# EAGLE design my (EAGLE 7.5.0)
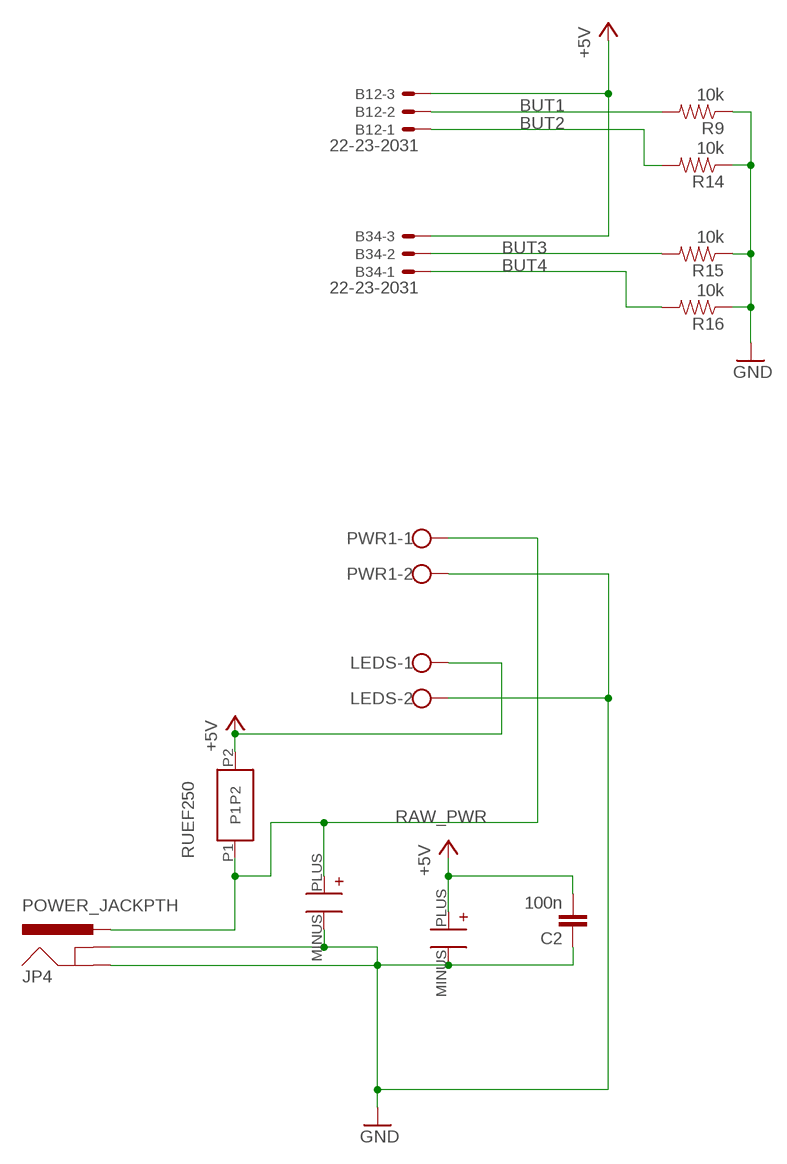
[diagram p0: schematic, sheet 1, part 1 of 2]
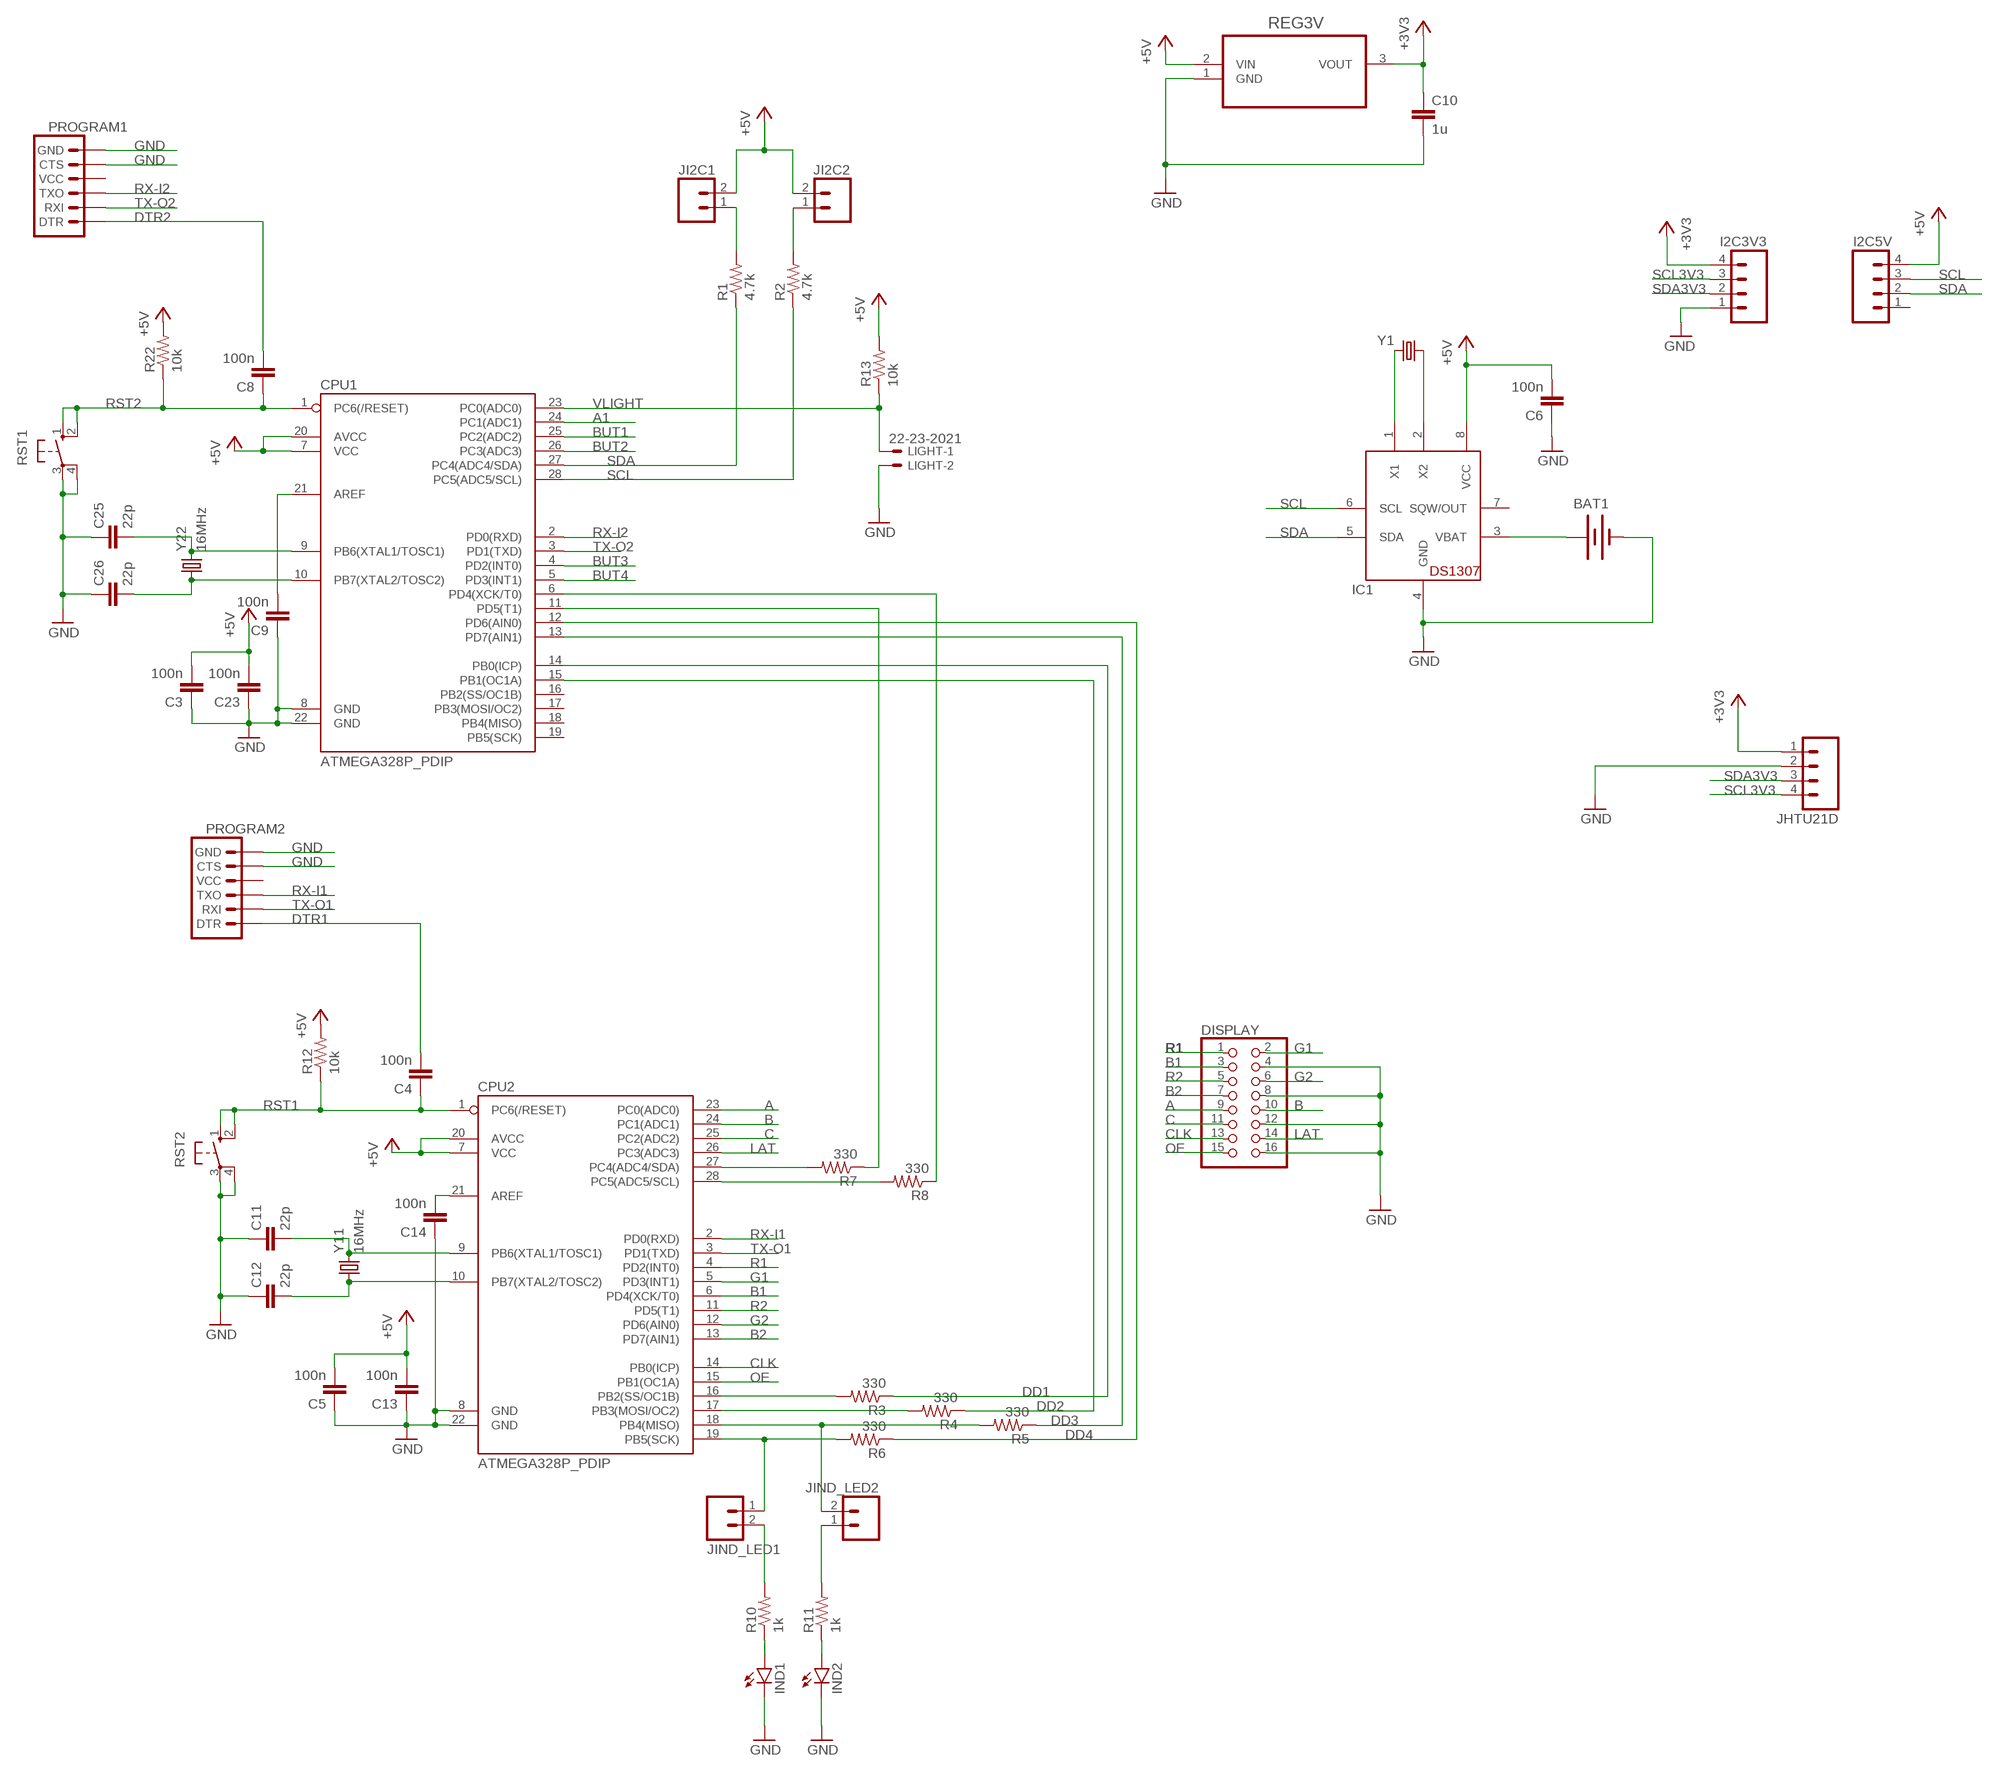
[diagram p1: schematic, sheet 1, part 2 of 2]

## Parts
B12  22-23-2031  [22-23-2031]
B34  22-23-2031  [22-23-2031]
BAT1  BATTERY12MM  [BATTCON_12MM]
C1  EEU-FR1C471B  [EEU-FR1C471B]
C2  100n  C-EU025-024X044  [C025-024X044]
C3  100n  C-EU025-024X044  [C025-024X044]
C4  100n  C-EU025-024X044  [C025-024X044]
C5  100n  C-EU025-024X044  [C025-024X044]
C6  100n  C-EU025-024X044  [C025-024X044]
C7  EEU-FR1C471B  [EEU-FR1C471B]
C8  100n  C-EU025-024X044  [C025-024X044]
C9  100n  C-EU025-024X044  [C025-024X044]
C10  1u  CAP_  [AXIAL-5MM]
C11  22p  C-EU025-024X044  [C025-024X044]
C12  22p  C-EU025-024X044  [C025-024X044]
C13  100n  C-EU025-024X044  [C025-024X044]
C14  100n  C-EU025-024X044  [C025-024X044]
C23  100n  C-EU025-024X044  [C025-024X044]
C25  22p  C-EU025-024X044  [C025-024X044]
C26  22p  C-EU025-024X044  [C025-024X044]
CPU1  ATMEGA328P_PDIP  [DIL28-3]
CPU2  ATMEGA328P_PDIP  [DIL28-3]
DISPLAY  PINHD-2X8  [2X08]
I2C3V3  M04PTH  [1X04]
I2C5V  M04PTH  [1X04]
IC1  DS1307  [DIL08]
IND1  LED5MM  [LED5MM]
IND2  LED5MM  [LED5MM]
JHTU21D  M04PTH  [1X04]
JI2C1  M02PTH  [1X02]
JI2C2  M02PTH  [1X02]
JIND_LED1  M02PTH  [1X02]
JIND_LED2  M02PTH  [1X02]
JP4  POWER_JACKPTH  [POWER_JACK_PTH]
LEDS  W237-102  [W237-102]
LIGHT  22-23-2021  [22-23-2021]
PROGRAM1  ARDUINO_SERIAL_PROGRAMPTH  [1X06]
PROGRAM2  ARDUINO_SERIAL_PROGRAMPTH  [1X06]
PWR1  W237-102  [W237-102]
R1  4.7k  RESISTORAXIAL-0.3  [AXIAL-0.3]
R2  4.7k  RESISTORAXIAL-0.3  [AXIAL-0.3]
R3  330  RESISTORAXIAL-0.3  [AXIAL-0.3]
R4  330  RESISTORAXIAL-0.3  [AXIAL-0.3]
R5  330  RESISTORAXIAL-0.3  [AXIAL-0.3]
R6  330  RESISTORAXIAL-0.3  [AXIAL-0.3]
R7  330  RESISTORAXIAL-0.3  [AXIAL-0.3]
R8  330  RESISTORAXIAL-0.3  [AXIAL-0.3]
R9  10k  RESISTORAXIAL-0.3  [AXIAL-0.3]
R10  1k  RESISTORAXIAL-0.3  [AXIAL-0.3]
R11  1k  RESISTORAXIAL-0.3  [AXIAL-0.3]
R12  10k  RESISTORAXIAL-0.3  [AXIAL-0.3]
R13  10k  RESISTORAXIAL-0.3  [AXIAL-0.3]
R14  10k  RESISTORAXIAL-0.3  [AXIAL-0.3]
R15  10k  RESISTORAXIAL-0.3  [AXIAL-0.3]
R16  10k  RESISTORAXIAL-0.3  [AXIAL-0.3]
R22  10k  RESISTORAXIAL-0.3  [AXIAL-0.3]
REG3V  MCP1700-3002E/TO  [TO127P254X495-3]
RST1  10-XX  [B3F-10XX]
RST2  10-XX  [B3F-10XX]
RUEF250  RUEF250U  [RUEF250U]
Y1  CRYSTAL32-SMD  [CRYSTAL-32KHZ-SMD]
Y11  16MHz  CRYSTALHC49US  [HC49US]
Y22  16MHz  CRYSTALHC49US  [HC49US]

## Nets
+3V3 [SUPPLY]: C10.P$1 I2C3V3.4 JHTU21D.1 REG3V.3(VOUT)
+5V [SUPPLYP]: B12.3 B34.3 C1.PLUS C2.2 C3.2 C5.2 C6.2 C13.2 C23.2 CPU1.7(VCC) CPU1.20(AVCC) CPU2.7(VCC) CPU2.20(AVCC) I2C5V.4 IC1.8(VCC) JI2C1.2 JI2C2.2 LEDS.1 R12.P$2 R13.P$2 R22.P$2 REG3V.2(VIN) RUEF250.P2
+5V1: JIND_LED1.2 R10.P$2
+5V2: JIND_LED2.1 R11.P$2
A: CPU2.23(PC0(ADC0)) DISPLAY.9
A1: CPU1.24(PC1(ADC1))
B: CPU2.24(PC1(ADC1)) DISPLAY.10
B1: CPU2.6(PD4(XCK/T0)) DISPLAY.3
B2: CPU2.13(PD7(AIN1)) DISPLAY.7
BUT1: B12.2 CPU1.25(PC2(ADC2)) R9.P$2
BUT2: B12.1 CPU1.26(PC3(ADC3)) R14.P$2
BUT3: B34.2 CPU1.4(PD2(INT0)) R15.P$2
BUT4: B34.1 CPU1.5(PD3(INT1)) R16.P$2
C: CPU2.25(PC2(ADC2)) DISPLAY.11
CLK: CPU2.14(PB0(ICP)) DISPLAY.13
DD1: CPU1.14(PB0(ICP)) R3.P$1
DD2: CPU1.15(PB1(OC1A)) R4.P$1
DD3: CPU1.13(PD7(AIN1)) R5.P$1
DD4: CPU1.12(PD6(AIN0)) R6.P$1
DTR1: C4.2 PROGRAM2.1(DTR)
DTR2: C8.2 PROGRAM1.1(DTR)
G1: CPU2.5(PD3(INT1)) DISPLAY.2
G2: CPU2.12(PD6(AIN0)) DISPLAY.6
GND [SUPPLY]: BAT1.GND(-) C1.MINUS C2.1 C3.1 C5.1 C6.1 C7.MINUS C9.1 C10.P$2 C11.1 C12.1 C13.1 C14.1 C23.1 C25.1 C26.1 CPU1.8(GND) CPU1.22(GND) CPU2.8(GND) CPU2.22(GND) DISPLAY.4 DISPLAY.8 DISPLAY.12 DISPLAY.16 I2C3V3.1 IC1.4(GND) IND1.K(C) IND2.K(C) JHTU21D.2 JP4.GND JP4.GNDBREAK LEDS.2 LIGHT.2 PROGRAM1.5(CTS) PROGRAM1.6(GND) PROGRAM2.5(CTS) PROGRAM2.6(GND) PWR1.2 R9.P$1 R14.P$1 R15.P$1 R16.P$1 REG3V.1(GND) RST1.3(P) RST1.4(P1) RST2.3(P) RST2.4(P1)
LAT: CPU2.26(PC3(ADC3)) DISPLAY.14
N$1 [OSC]: C11.2 CPU2.9(PB6(XTAL1/TOSC1)) Y11.2
N$2 [OSC]: C12.2 CPU2.10(PB7(XTAL2/TOSC2)) Y11.1
N$3 [OSC]: C25.2 CPU1.9(PB6(XTAL1/TOSC1)) Y22.2
N$4 [OSC]: C26.2 CPU1.10(PB7(XTAL2/TOSC2)) Y22.1
N$5: CPU1.11(PD5(T1)) R7.P$1
N$6: CPU2.19(PB5(SCK)) JIND_LED1.1 R6.P$2
N$7: CPU2.18(PB4(MISO)) JIND_LED2.2 R5.P$2
N$8: CPU2.17(PB3(MOSI/OC2)) R4.P$2
N$9: CPU2.16(PB2(SS/OC1B)) R3.P$2
N$10: CPU2.27(PC4(ADC4/SDA)) R7.P$2
N$11: CPU2.28(PC5(ADC5/SCL)) R8.P$2
N$12: CPU1.6(PD4(XCK/T0)) R8.P$1
N$13: C9.2 CPU1.21(AREF)
N$14: C14.2 CPU2.21(AREF)
N$17: JI2C1.1 R1.P$2
N$18: JI2C2.1 R2.P$2
N$19: IND2.A R11.P$1
N$20: IND1.A R10.P$1
N$24: BAT1.PWR@1(+) IC1.3(VBAT)
N$25: IC1.1(X1) Y1.X2
N$26: IC1.2(X2) Y1.X1
OE: CPU2.15(PB1(OC1A)) DISPLAY.15
R1: CPU2.4(PD2(INT0)) DISPLAY.1
R2: CPU2.11(PD5(T1)) DISPLAY.5
RAW_PWR [SUPPLY]: C7.PLUS JP4.PWR PWR1.1 RUEF250.P1
RST1: C4.1 CPU2.1(PC6(/RESET)) R12.P$1 RST2.1(S) RST2.2(S1)
RST2: C8.1 CPU1.1(PC6(/RESET)) R22.P$1 RST1.1(S) RST1.2(S1)
RX-I1: CPU2.2(PD0(RXD)) PROGRAM2.3(TXO)
RX-I2: CPU1.2(PD0(RXD)) PROGRAM1.3(TXO)
SCL: CPU1.28(PC5(ADC5/SCL)) I2C5V.3 IC1.6(SCL) R2.P$1
SCL3V3: I2C3V3.3 JHTU21D.4
SDA: CPU1.27(PC4(ADC4/SDA)) I2C5V.2 IC1.5(SDA) R1.P$1
SDA3V3: I2C3V3.2 JHTU21D.3
TX-O1: CPU2.3(PD1(TXD)) PROGRAM2.2(RXI)
TX-O2: CPU1.3(PD1(TXD)) PROGRAM1.2(RXI)
VLIGHT: CPU1.23(PC0(ADC0)) LIGHT.1 R13.P$1
Unconnected: CPU1.16(PB2(SS/OC1B)) CPU1.17(PB3(MOSI/OC2)) CPU1.18(PB4(MISO)) CPU1.19(PB5(SCK)) I2C5V.1 IC1.7(SQW/OUT) PROGRAM1.4(VCC) PROGRAM2.4(VCC)

## Library data of the parts
B12 B34 = con-molex:22-23-2031: .100" (2.54mm) Center Header - 3 Pin; MF: MOLEX; MPN: 22-23-2031; OC_FARNELL: 1462950; OC_NEWARK: 30C0862
BAT1 = SparkFun-Electromechanical:BATTERY: Battery Holders Various common sizes : AA, AAA, 18650 (PRT-12895), 20mm coin cell and 12mm coin cell. 20MM_4LEGS, BATT-10373; PROD_ID: BATT-08044
C1 C7 = my:EEU-FR1C471B
C2-C6 C8 C9 C11-C14 C23 C25 C26 = rcl:C-EU: CAPACITOR, European symbol
C10 = SparkFun-Passives:CAP: Capacitor Standard 0603 ceramic capacitor, and 0.1" leaded capacitor.
CPU1 CPU2 = SparkFun-DigitalIC:ATMEGA328P_PDIP: uC used in the Arduino 32kb flash, 1k EEPROM, 2k SRAM This is the through-hole version of this chip.
DISPLAY = pinhead:PINHD-2X8: PIN HEADER
I2C3V3 I2C5V JHTU21D = SparkFun-Connectors:M04: Header 4 Standard 4-pin 0.1" header. Use with straight break away headers (SKU : PRT-00116), right angle break away headers (PRT-00553), swiss pins (PRT-00743), machine pins (PRT-00117), and female headers (PRT-00115). Molex polarized connector foot print use with SKU : PRT-08231 with associated crimp pins and housings. 1MM SMD Version SKU: PRT-10208
IC1 = adafruit:DS1307: DS1307 Real time clock (RTC) with battery backup ability. Talk to it via i2c
IND1 IND2 = SparkFun-LED:LED: LEDs Standard schematic elements and footprints for 5mm, 3mm, 1206, and 0603 sized LEDs. 5mm - Spark Fun Electronics SKU : COM-00529 (and others)
JI2C1 JI2C2 JIND_LED1 JIND_LED2 = SparkFun-Connectors:M02: Standard 2-pin 0.1" header. Use with - straight break away headers ( PRT-00116) - right angle break away headers (PRT-00553) - swiss pins (PRT-00743) - machine pins (PRT-00117) - female headers (PRT-00115) Molex polarized connector foot print use with: PRT-08233 with associated crimp pins and housings. 2.54_SCREWTERM for use with PRT-10571. 3.5mm Screw Terminal footprints for PRT-08084 5mm Screw Terminal footprints for use with PRT-08432
JP4 = SparkFun-Connectors:POWER_JACK: Power Jack This is the standard 5.5mm barrel jack for power. The PTH is the most common, proven, reliable, footprint. The Slot footprint only works if the mill layer is transmitted to the PCB fab house so be warned. Mating wall wart : TOL-00298 (and others); PROD_ID: CONN-08197
LEDS PWR1 = con-wago-500:W237-102: WAGO SCREW CLAMP; MPN: 237-102; OC_FARNELL: unknown; OC_NEWARK: 70K9898
LIGHT = con-molex:22-23-2021: .100" (2.54mm) Center Header - 2 Pin; MF: MOLEX; MPN: 22-23-2021; OC_FARNELL: 1462926; OC_NEWARK: 25C3832
PROGRAM1 PROGRAM2 = SparkFun-Connectors:ARDUINO_SERIAL_PROGRAM: FTDI connector footprints
R1-R16 R22 = SparkFun-Passives:RESISTOR: Resistor Basic schematic elements and footprints for 0603, 1206, and PTH resistors.
REG3V = Microchip_By_element14_Batch_1:MCP1700-3002E/TO: IC REG LDO 250MA 3.0V; MPN: MCP1700-3002E/TO; OC_FARNELL: 1331480; OC_NEWARK: 34M7414; PACKAGE: TO-92; SUPPLIER: Microchip
RST1 RST2 = switch-omron:10-XX: OMRON SWITCH; MPN: B3F-1000; OC_FARNELL: 176432; OC_NEWARK: 36M3542
RUEF250 = my:RUEF250U
Y1 = SparkFun-FreqCtrl:CRYSTAL: Various standard crystals. Proven footprints.; PROD_ID: XTAL-07894
Y11 Y22 = SparkFun-FreqCtrl:CRYSTAL: Various standard crystals. Proven footprints.

## Net classes
0 default: width 0.254 mm, drill 0.381 mm, clearance 0.254 mm
1 SUPPLY: width 0.508 mm, drill 0.762 mm, clearance 0.254 mm to class 0, clearance 0.254 mm
2 SUPPLYP: width 0.762 mm, drill 0.762 mm, clearance 0.254 mm to class 0, clearance 0.254 mm to class 1, clearance 0.254 mm
3 OSC: width 0.254 mm, drill 0.381 mm, clearance 0.381 mm to class 0, clearance 0.381 mm to class 1, clearance 0.381 mm to class 2, clearance 0.381 mm

## Board
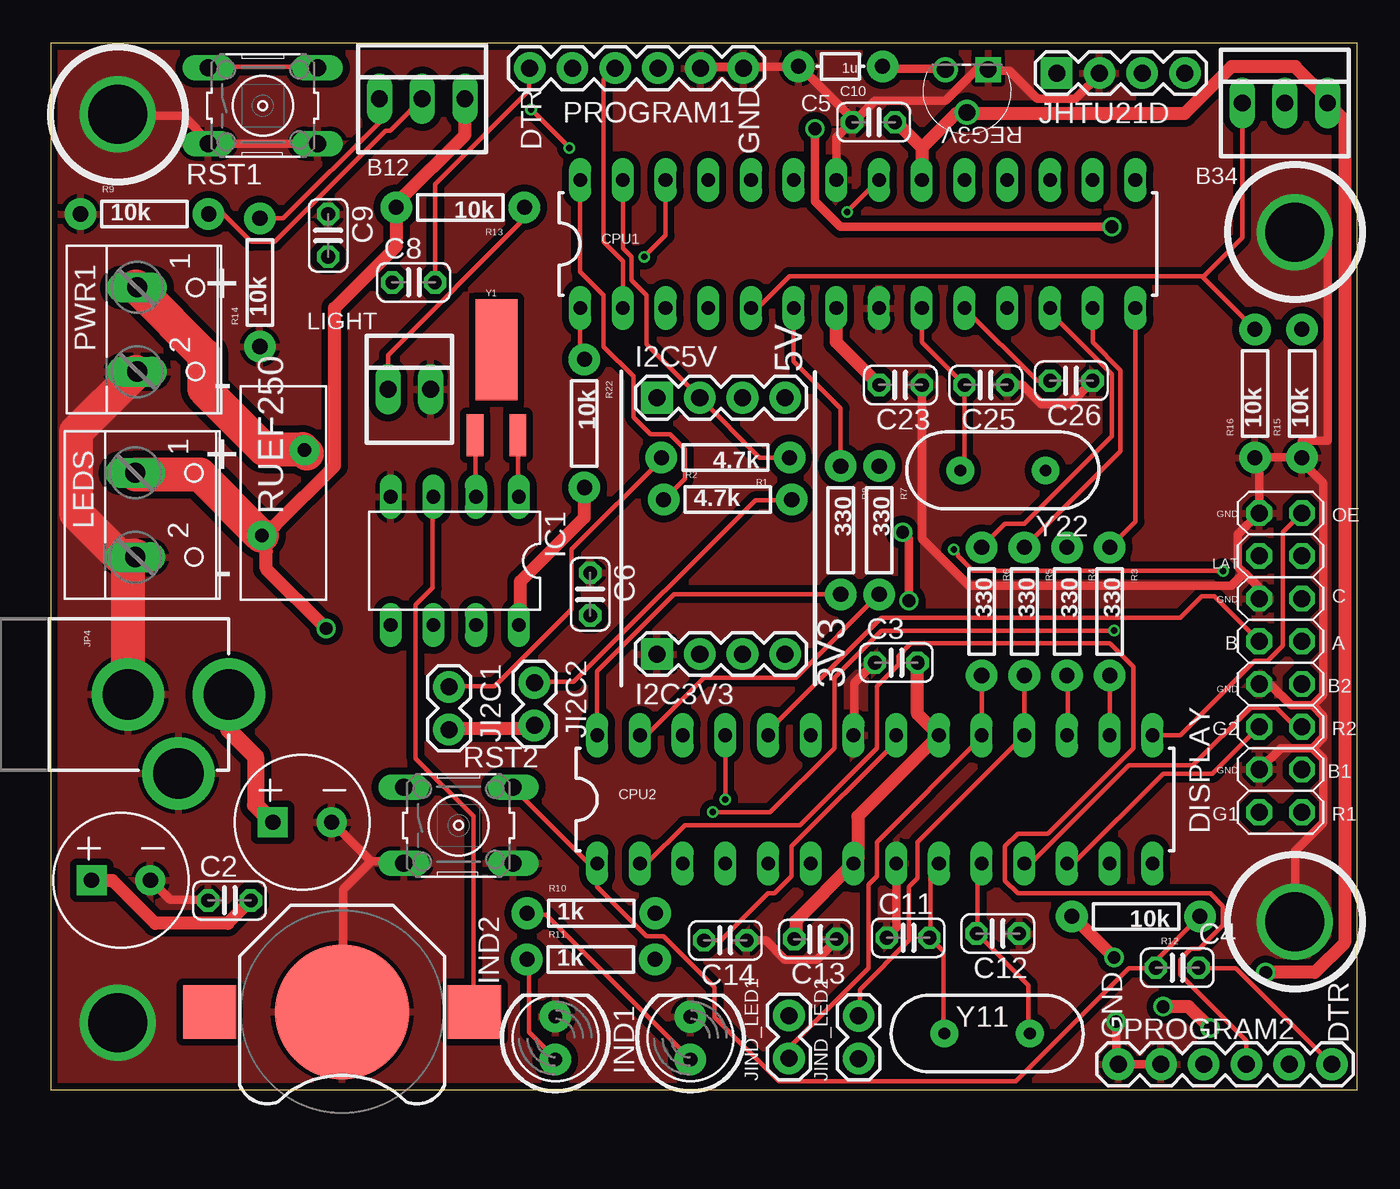
[diagram p2: board, top side]
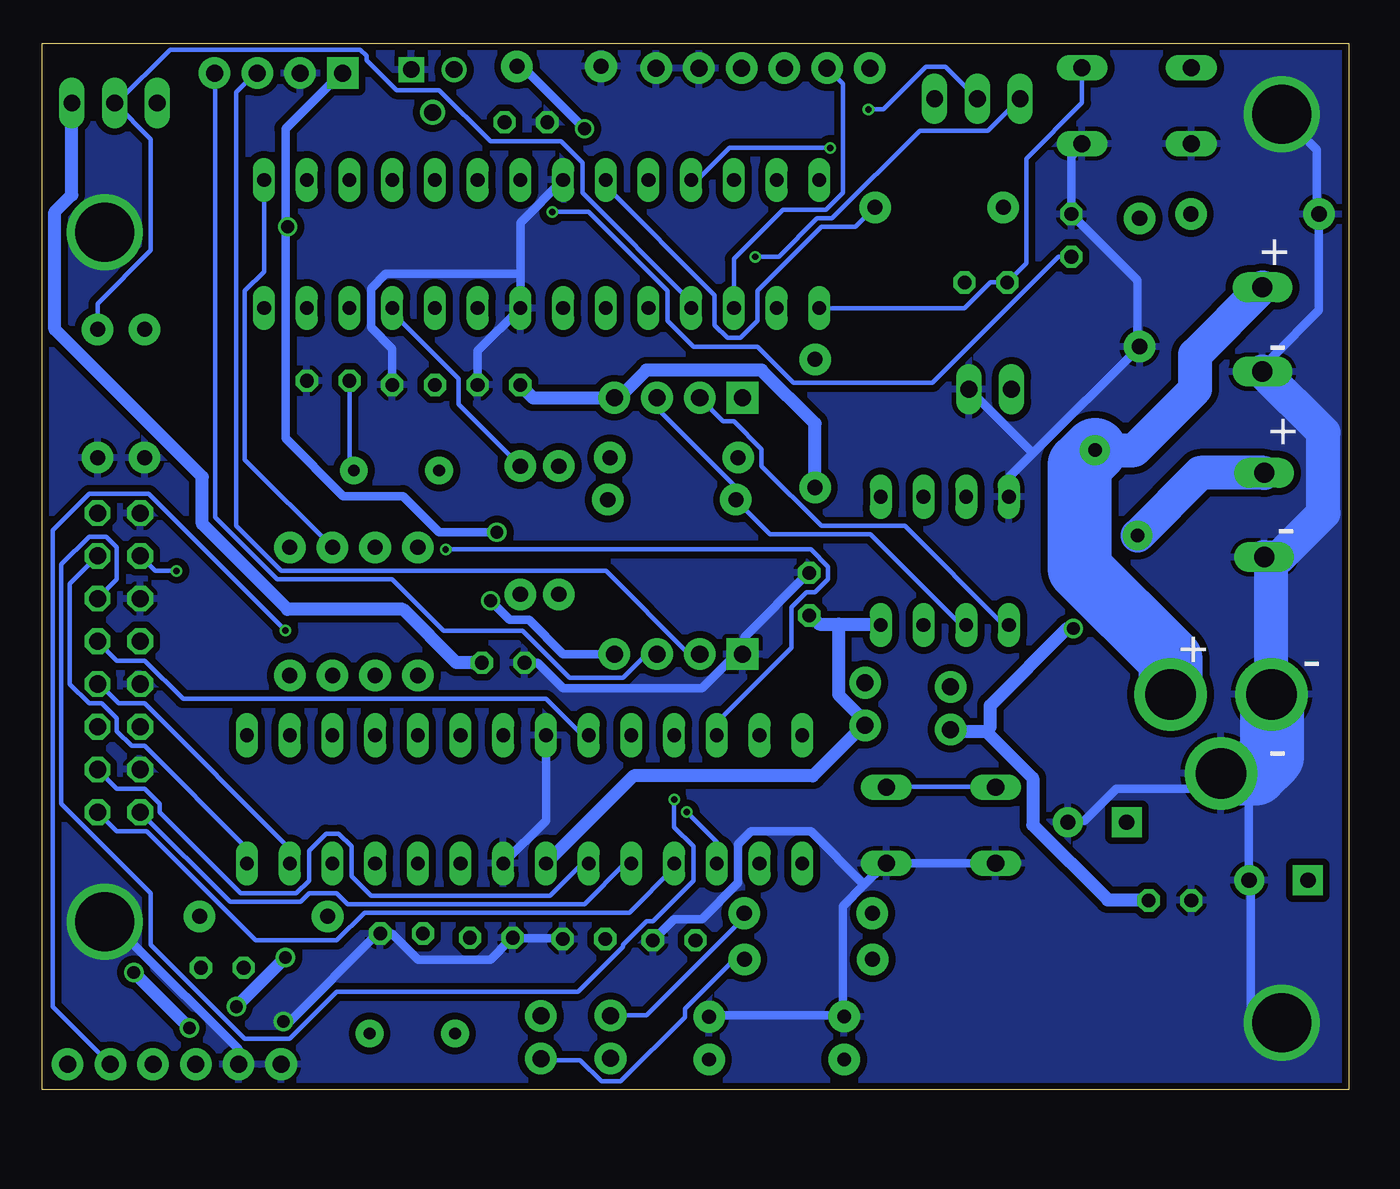
[diagram p3: board, bottom side, seen from below]

Size 77.72 x 62.23 mm. Coordinates in mm from the lower left corner, seen from the top.
Outline: 0,0 77.72,0 77.72,62.23 0,62.23 0,0
Copper layers (1*16): Top 0.035mm / dielectric 1.5mm / Bottom 0.035mm
Design rules "SeeedStudio_2layer_DRU_no_angle_20140221": minimum track width 6mil, minimum drill 12mil, track to track 6mil, track to pad 6mil, pad to pad 6mil, via to via 6mil, smd to smd 0mil, copper to edge 10mil, drill to drill 10mil, minimum pad ring 10mil, minimum via ring 6mil, stop-mask expansion 2mil, vias tented up to drill 100mil, thermal gap 10mil

### Footprints (pad centres in the part's own frame; a part is rotated, then mirrored left to right if it is on the bottom)
22-23-2031 = drill 1 long: 1 -2.54,0; 2 0,0; 3 2.54,0
BATTCON_12MM = smd 8 x 8: GND 0,0 | smd 3.175 x 3.175: PWR@1 -7.874,0; PWR@2 7.874,0
EEU-FR1C471B = drill 0.9 pad 1.778: MINUS 1.75,0 | drill 0.9 pad 1.778 square: PLUS -1.75,0
C025-024X044 = drill 0.813 octagon: 1 -1.27,0; 2 1.27,0
AXIAL-5MM = drill 0.9 pad 1.88: P$1 -2.5,0; P$2 2.5,0
DIL28-3 = drill 0.813 long: 1 -16.51,-3.81; 2 -13.97,-3.81; 3 -11.43,-3.81; 4 -8.89,-3.81; 5 -6.35,-3.81; 6 -3.81,-3.81; 7 -1.27,-3.81; 8 1.27,-3.81; 9 3.81,-3.81; 10 6.35,-3.81; 11 8.89,-3.81; 12 11.43,-3.81; 13 13.97,-3.81; 14 16.51,-3.81; 15 16.51,3.81; 16 13.97,3.81; 17 11.43,3.81; 18 8.89,3.81; 19 6.35,3.81; 20 3.81,3.81; 21 1.27,3.81; 22 -1.27,3.81; 23 -3.81,3.81; 24 -6.35,3.81; 25 -8.89,3.81; 26 -11.43,3.81; 27 -13.97,3.81; 28 -16.51,3.81
2X08 = drill 1.016 octagon: 1 -8.89,-1.27; 2 -8.89,1.27; 3 -6.35,-1.27; 4 -6.35,1.27; 5 -3.81,-1.27; 6 -3.81,1.27; 7 -1.27,-1.27; 8 -1.27,1.27; 9 1.27,-1.27; 10 1.27,1.27; 11 3.81,-1.27; 12 3.81,1.27; 13 6.35,-1.27; 14 6.35,1.27; 15 8.89,-1.27; 16 8.89,1.27
1X04 = drill 1.016 pad 1.88 square: 1 0,0 | drill 1.016 pad 1.88: 2 2.54,0; 3 5.08,0; 4 7.62,0
DIL08 = drill 0.813 long: 1 -3.81,-3.81; 2 -1.27,-3.81; 3 1.27,-3.81; 4 3.81,-3.81; 5 3.81,3.81; 6 1.27,3.81; 7 -1.27,3.81; 8 -3.81,3.81
LED5MM = drill 0.813 pad 1.88: A -1.27,0; K 1.27,0
1X02 = drill 1.016 pad 1.88: 1 0,0; 2 2.54,0
POWER_JACK_PTH = drill 2.997 pad 4.318: GND 0,7.7; GNDBREAK 4.7,10.7; PWR 0,13.7
W237-102 = drill 1.194 long: 1 -2.5,-1.27; 2 2.5,-1.27
22-23-2021 = drill 1 long: 1 -1.27,0; 2 1.27,0
1X06 = drill 1.016 pad 1.88: 1 0,0; 2 2.54,0; 3 5.08,0; 4 7.62,0; 5 10.16,0; 6 12.7,0
AXIAL-0.3 = drill 0.9 pad 1.88: P$1 -3.81,0; P$2 3.81,0
TO127P254X495-3 = drill 0.991 square: 1 -2.54,-2.54 | drill 0.991: 2 -1.27,0; 3 0,-2.54
B3F-10XX = drill 1.016 long: 1 -3.251,2.261; 2 3.251,2.261; 3 -3.251,-2.261; 4 3.251,-2.261
RUEF250U = drill 0.8 pad 1.778: P1 2.54,-1.27; P2 -2.54,1.27
CRYSTAL-32KHZ-SMD = smd 2.5 x 6: SHEILD 0,5.08 | smd 1 x 2.5: X1 -1.27,0; X2 1.27,0
HC49US = drill 0.7 pad 1.651: 1 -2.54,0; 2 2.54,0

### Placement (x,y rotation side)
B12  22.1,58.93 0 top
B34  73.41,58.67 0 top
BAT1  17.34,4.63 180 top
C1  4.19,12.45 0 top
C2  10.64,11.27 0 top
C3  50.29,25.4 0 top
C4  67.01,7.26 0 top
C5  48.95,57.53 0 top
C6  32.09,29.47 270 top
C7  14.97,15.91 0 top
C8  21.59,48.01 0 top
C9  16.51,50.8 270 top
C10  46.98,60.85 180 top
C11  51,9.04 0 top
C12  56.34,9.3 180 top
C13  45.49,8.97 180 top
C14  40.13,8.89 180 top
C23  50.55,41.91 180 top
C25  55.63,41.91 180 top
C26  60.71,42.16 180 top
CPU1  48.01,50.29 0 top
CPU2  49.02,17.27 0 top
DISPLAY  73.15,25.4 90 top
I2C3V3  36.07,25.91 0 top
I2C5V  36.07,41.15 0 top
IC1  24.03,31.45 180 top
IND1  38.05,3.08 90 top
IND2  30.02,3.09 90 top
JHTU21D  59.84,60.45 0 top
JI2C1  23.7,23.96 270 top
JI2C2  28.78,24.21 270 top
JIND_LED1  43.92,1.88 90 top
JIND_LED2  48.05,1.86 90 top
JP4  -3.09,23.52 270 top
LEDS  6.31,34.18 270 top
LIGHT  21.34,41.66 0 top
PROGRAM1  28.5,60.74 0 top
PROGRAM2  76.2,1.52 180 top
PWR1  6.41,45.21 270 top
R1  40.14,37.59 180 top
R2  40.27,35.09 0 top
R3  62.99,28.45 270 top
R4  60.45,28.45 270 top
R5  57.91,28.45 270 top
R6  55.37,28.45 270 top
R7  49.28,33.27 270 top
R8  46.99,33.27 270 top
R9  5.59,52.07 0 top
R10  32.15,10.51 0 top
R11  32.14,7.76 0 top
R12  64.55,10.32 180 top
R13  24.37,52.47 180 top
R14  12.45,48.01 90 top
R15  74.42,41.4 90 top
R16  71.63,41.4 90 top
R22  31.75,39.62 270 top
REG3V  53.22,58.12 180 top
RST1  12.62,58.51 0 top
RST2  24.26,15.72 0 top
RUEF250  13.84,35.5 90 top
Y1  26.52,38.91 0 top
Y11  55.7,3.35 180 top
Y22  56.64,36.83 180 top

### Tracks (layer width: path | path; a pad name or v marks a point on that pad's centre or on a via)
+3V3  (via drill 0.76)
  Top 0.508: REG3V.3 53.21,60.71 49.66,60.71 49.53,60.83 C10.P$1 | v51.05,29.08 51.05,32.77 v50.67,33.15 | v45.47,57.15 45.47,52.83 46.99,51.31 v63.12,51.31
  Bottom 0.508: I2C3V3.4 46.74,25.91 48.77,27.94 49.91,27.94 v51.05,29.08 | v50.67,33.15 54.1,33.15 56.26,35.31 59.82,35.31 63.25,38.73 63.25,51.31 | 63.25,51.31 63.25,57.15 59.94,60.45 JHTU21D.1 | v45.47,57.15 49.15,60.83 49.4,60.83 C10.P$1 | v63.12,51.31 63.25,51.31
+5V  (via drill 0.76)
  Top 0.762: CPU1.7 46.74,44.45 C23.2 | 51.82,56.01 CPU1.20 | 51.82,56.01 50.29,57.53 C5.2 | 51.82,56.01 53.85,58.04 54.48,58.04 REG3V.2 54.86,58.04 67.44,58.04 70.23,60.83 74.04,60.83 75.95,58.93 B34.3 76.96,57.66 76.96,8.76 75.18,6.99 v72.26,6.99 | C13.2 44.32,9.02 44.32,10.03 CPU2.7 48.01,13.72 48.01,16.26 CPU2.20 51.56,22.35 C3.2 | JI2C1.2 23.75,21.46 28.57,21.46 28.7,21.59 JI2C2.2 | R22.P$2 31.75,34.04 27.94,30.23 27.94,27.69 IC1.8 | v16.38,27.43 12.83,30.99 12.83,32 RUEF250.P2 13.34,33.53 16.89,37.08 16.89,46.48 20.57,50.16 20.57,52.07 R13.P$2 20.7,52.83 24.64,56.77 B12.3 | C1.PLUS 2.54,12.45 3.68,12.45 6.22,9.91 10.54,9.91 11.81,11.18 C2.2 | v63.25,7.87 60.83,10.29 R12.P$2 | v66.17,4.95 67.69,4.95 v68.96,3.68
  Top 2.032: RUEF250.P2 12.51,32.96 8.89,36.58 5.08,36.58
  Bottom 0.762: C23.2 48.51,41.15 I2C5V.4 43.43,41.4 43.18,41.4 41.78,42.8 34.92,42.8 31.75,39.62 R22.P$2 | 30.35,27.69 31.5,27.69 32,28.19 C6.2 | 30.35,27.69 27.94,27.69 IC1.8 | 30.35,27.69 30.35,23.5 28.83,21.97 28.83,21.72 JI2C2.2 29.08,21.46 31.88,18.67 42.55,18.67 CPU2.7 | 21.59,21.34 18.8,18.54 18.8,15.75 14.35,11.3 11.94,11.3 C2.2 | 21.59,21.34 23.62,21.34 JI2C1.2 | v16.38,27.43 16.76,27.43 21.34,22.86 21.34,21.59 21.59,21.34 | B34.3 75.95,53.21 76.96,52.2 76.96,45.21 68.2,36.45 68.2,33.66 63.12,28.57 56.26,28.57 53.09,25.4 C3.2 | v66.17,4.95 v63.25,7.87 | v72.26,6.99 v68.96,3.68
  Bottom 2.032: LEDS.1 8.85,36.68 RUEF250.P2
+5V1
  Bottom 0.254: R10.P$2 36.07,10.41 36.07,10.16 41.78,4.45 43.81,4.45 JIND_LED1.2
+5V2
  Bottom 0.254: JIND_LED2.1 48.01,1.78 45.72,1.78 44.45,0.51 43.31,0.51 39.5,4.32 39.5,4.83 36.58,7.75 36.07,7.75 R11.P$2
A
  Bottom 0.254: CPU2.23 45.59,21.08 47.75,23.24 69.34,23.24 71.63,25.53 73.28,25.53 DISPLAY.9
B
  Top 0.254: CPU2.24 42.67,21.34 49.4,28.07 67.18,28.07 68.45,29.34 69.22,29.34 DISPLAY.10
B1
  Bottom 0.254: CPU2.6 45.59,13.46 47.5,11.56 58.17,11.56 59.31,12.7 59.31,14.48 60.07,15.24 60.83,15.24 61.85,14.22 61.85,12.45 62.61,11.68 65.91,11.68 70.74,16.51 70.74,17.02 71.63,17.91 73.28,17.91 DISPLAY.3
B2
  Bottom 0.254: 74.4,24.1 DISPLAY.7 74.3,24.13 73.15,22.99 71.63,22.99 62.99,14.35 CPU2.13
BUT1  (via drill 0.38)
  Top 0.254: v28.57,58.29 v30.86,56.01 | R9.P$2 10.29,52.07 11.94,50.42 13.34,50.42 19.94,57.02 20.19,57.02 B12.2
  Bottom 0.254: CPU1.25 38.73,54.1 36.83,56.01 v30.86,56.01 | v28.57,58.29 27.69,58.29 25.15,60.83 24,60.83 B12.2
BUT2  (via drill 0.38)
  Top 0.254: R14.P$2 13.84,51.82 19.56,57.53 B12.1 | CPU1.26 36.58,50.8 v35.31,49.53
  Bottom 0.254: v35.31,49.53 33.91,49.53 31.62,51.82 30.73,51.82 25.53,57.02 21.46,57.02 B12.1
BUT3
  Bottom 0.254: R15.P$2 74.42,46.74 71.25,49.91 71.25,56.52 B34.2 73.28,58.67 70.1,61.85 58.8,61.85 58.42,61.47 58.42,61.21 56.64,59.44 54.1,59.44 51.05,56.39 46.86,56.39 45.59,55.12 45.59,53.34 39.12,46.86 CPU1.4
BUT4
  Top 0.254: CPU1.5 42.04,46.48 43.94,48.39 68.45,48.39 68.52,48.32 | R16.P$2 68.52,48.32 | B34.1 70.87,50.67 68.52,48.32
C  (via drill 0.38)
  Top 0.254: v40.13,17.27 CPU2.25
  Bottom 0.254: v40.13,17.27 40.13,15.62 38.99,14.48 38.99,12.45 41.4,10.03 41.78,10.03 43.18,8.64 43.18,8.51 45.85,5.84 60.2,5.84 62.99,3.05 65.66,3.05 71.25,8.64 71.25,11.68 76.58,17.02 76.58,31.24 74.93,32.89 73.91,32.89 73.28,32.26 73.28,30.35 DISPLAY.11
CLK
  Bottom 0.254: CPU2.14 65.53,14.35 71.63,20.45 72.39,20.45 73.28,21.34 73.28,22.1 74.17,22.99 74.93,22.99 76.07,24.13 76.07,30.1 DISPLAY.13
DD1
  Top 0.254: CPU1.14 64.52,33.78 R3.P$1
DD2
  Bottom 0.254: CPU1.15 64.52,48.64 65.66,47.5 65.66,37.47 R4.P$1
DD3
  Top 0.254: CPU1.13 61.98,44.45 63.63,42.8 63.63,37.97 R5.P$1
DD4
  Top 0.254: CPU1.12 59.44,46.23 63.12,42.55 63.12,38.86 57.91,33.66 56.77,33.66 R6.P$1
DTR1
  Top 0.254: PROGRAM2.1 70.48,7.24 68.33,7.24 C4.2
DTR2
  Top 0.254: C8.2 22.86,53.85 28.45,59.44 28.45,60.71 PROGRAM1.1
G1
  Bottom 0.254: CPU2.5 43.05,13.46 45.47,11.05 59.56,11.05 60.2,11.68 61.85,11.68 62.36,11.18 66.55,11.18 DISPLAY.2
G2
  Top 0.254: CPU2.12 60.83,13.46 66.17,18.8 69.09,18.8 DISPLAY.6
GND  (via drill 0.76, 3.5)
  Top 0.508: R15.P$1 74.2,37.6 71.7,37.6 R16.P$1 71.88,37.47 DISPLAY.16 70.61,33.02 70.61,31.11 70.99,30.73 | CPU2.22 47.8,21.1 47.8,24.2 49,25.4 C3.1 | C2.1 9.3,11.3 7.1,11.3 6,12.4 C1.MINUS | 75.06,20.32 75.69,19.68 75.69,15.88 74.04,14.22 74.04,10.03 v74,10 | 75.06,20.32 73.15,20.32 DISPLAY.4 | 19.05,13.59 20.95,13.59 RST2.3 | 19.05,13.59 16.76,15.88 C7.MINUS | 19.05,13.59 17.4,11.94 17.4,4.7 BAT1.GND | v4,58 4.06,57.91 7.87,57.91 9.53,56.26 RST1.3 9.78,56.26 15.75,56.26 RST1.4 | JHTU21D.2 62.48,60.45 60.96,58.93 58.67,58.93 57.02,60.58 55.88,60.58 REG3V.1 55.5,60.71 55.12,60.71 53.21,58.8 49.02,58.8 47.88,57.66 C5.1 | CPU1.22 46.74,56.64 47.62,57.53 C5.1 | C5.1 47.5,57.66 47.5,57.91 44.7,60.71 C10.P$2 44.32,60.83 41.4,60.83 PROGRAM1.6 41.15,60.83 38.73,60.83 PROGRAM1.5 | DISPLAY.12 71.88,29.84 70.99,30.73 | DISPLAY.8 72.52,24.13 73.79,22.86 75.06,22.86 | 75.06,22.86 75.69,22.23 75.69,20.95 75.06,20.32 | 75.06,22.86 75.69,23.5 75.69,36.07 74.42,37.34 R15.P$1 | PROGRAM2.5 PROGRAM2.6 63.37,1.65 v63.37,4.06 | CPU2.8 50.29,9.65 49.78,9.14 C11.1 | C25.1 57.78,41.91 58.93,40.77 60.58,40.77 C26.1 | C23.1 51.82,32.77 54.61,29.97 70.23,29.97 70.99,30.73 | C14.1 42.55,8.89 43.69,7.75 45.59,7.75 46.74,8.89 C13.1 | v74,51 75.95,51 75.95,38.61 74.42,38.61 R15.P$1
  Top 2.032: JP4.GND 4.61,31.28 5.08,31.75 4.06,31.75 1.52,34.29 1.52,39.12 5.08,42.67
  Bottom 0.508: 4.06,4.06 v4,4 5.84,4.19 5.84,12.45 C1.MINUS 5.97,12.7 5.97,17.02 5.57,18.82 | 1.78,52.32 R9.P$1 | IND1.K 37.97,4.45 30.1,4.45 IND2.K 30.1,4.7 30.1,10.92 28.83,12.19 | RST2.3 21.08,13.46 27.43,13.46 RST2.4 27.69,13.34 28.83,12.19 | 18.8,37.85 R14.P$1 12.57,44.32 12.57,48.13 C9.1 16.51,55.5 15.88,56.13 RST1.4 | 18.8,37.85 20.19,36.45 20.19,35.31 IC1.4 | R9.P$1 1.91,52.45 1.91,55.88 3.94,57.91 v4,58 | R9.P$1 1.78,46.35 4.57,43.56 PWR1.2 | 49.28,48.51 49.28,51.56 CPU1.22 | 49.28,48.51 CPU1.8 51.82,43.94 C23.1 | C13.1 46.86,9.02 49.66,9.02 C11.1 49.91,8.89 51.05,7.75 55.37,7.75 56.9,9.27 57.4,9.27 C12.1 57.78,9.27 62.99,4.06 v63.37,4.06 63.5,4.19 | CPU2.22 47.75,16 CPU2.8 | C3.1 48.26,25.4 46.74,23.88 38.48,23.88 36.58,25.78 36.2,25.78 I2C3V3.1 35.94,26.04 35.94,26.92 32.13,30.73 C6.1 | 72.52,9.91 73.91,9.91 v74,10 72.39,9.78 72.39,8.76 66.04,2.41 PROGRAM2.5 | 18.8,37.85 LIGHT.2 | C7.MINUS 16.64,16 15.75,16 13.84,17.91 9.27,17.91 JP4.GNDBREAK | C25.1 56.9,44.07 58.17,45.34 58.17,47.62 57.28,48.51 49.28,48.51 | 28.83,12.19 32,15.37 35.56,15.37 36.32,14.61 36.32,12.32 38.48,10.16 40.13,10.16 C14.1
  Bottom 2.032: PWR1.2 1.52,39.09 1.52,34.29 4.13,31.68 LEDS.2 4.61,31.24 JP4.GND
  Bottom 3.81: JP4.GNDBREAK 5.57,18.82 4.57,19.81 4.57,23.48 JP4.GND
  pour Top (isolate 0.406): 0,62.23 77.72,62.23 77.72,0 0,0
  pour Bottom (isolate 0.406): 0,62.23 77.72,62.23 77.72,0 0,0
LAT  (via drill 0.38)
  Top 0.254: v53.72,32.13 53.98,31.88 53.98,31.75 54.86,30.86 v69.72,30.86
  Bottom 0.254: CPU2.26 37.59,21.84 33.15,26.29 33.15,28.7 32.26,29.59 31.75,29.59 30.99,30.35 30.99,31.11 32,32.13 v53.72,32.13 | v69.72,30.86 70.99,30.86 DISPLAY.14
N$1
  Top 0.254: CPU2.9 52.32,12.95 52.32,9.14 C11.2 52.32,9.02 53.09,8.26 53.09,3.43 Y11.2
N$2
  Top 0.254: CPU2.10 55.12,13.21 55.12,9.4 C12.2 55.12,9.27 58.17,6.22 58.17,3.43 Y11.1
N$3
  Top 0.254: Y22.2 54.36,37.08 C25.2 51.82,44.45 CPU1.9
N$4
  Top 0.254: CPU1.10 58.67,42.16 C26.2
  Bottom 0.254: C26.2 59.44,37.08 Y22.1
N$5
  Bottom 0.254: CPU1.11 56.9,46.23 52.96,42.29 52.96,40.77 R7.P$1
N$6
  Top 0.254: R6.P$2 55.4,24.6 55.4,21.1 CPU2.19 55.37,20.95 49.15,14.73 49.15,12.7 48.64,12.19 48.64,7.24 43.94,2.54 43.94,1.91 JIND_LED1.1
N$7
  Top 0.254: R5.P$2 CPU2.18 51.56,14.73 51.56,12.57 51.05,12.06 51.05,8.89 48.13,5.97 48.13,4.45 JIND_LED2.2
N$8
  Top 0.254: CPU2.17 60.5,21.1 60.5,24.6 R4.P$2
N$9
  Top 0.254: CPU2.16 63,21.1 63,24.6 R3.P$2
N$10
  Top 0.254: CPU2.27 35.43,21.08 38.86,24.51 44.32,24.51 R7.P$2
N$11
  Top 0.254: CPU2.28 32.51,24.89 37.08,29.46 R8.P$2
N$12
  Top 0.254: CPU1.6 44.2,43.31 46.99,40.51 R8.P$1
N$13  (via drill 0.38)
  Top 0.254: CPU1.21 v47.37,52.2
  Bottom 0.254: C9.2 17.27,49.53 24.77,42.04 33.02,42.04 35.18,44.2 38.99,44.2 40.51,45.72 40.51,47.5 45.21,52.2 v47.37,52.2
N$14
  Top 0.254: C14.2 39.88,8.89 42.67,11.68 43.05,11.68 44.07,12.7 44.07,14.48 50.29,20.7 CPU2.21
N$17
  Top 0.254: JI2C1.1 23.75,24 26.42,24 30.99,28.57 30.99,32.13 36.45,37.59 R1.P$2
N$18
  Top 0.254: JI2C2.1 28.83,24.26 31.11,24.26 41.91,35.05 44.07,35.05 R2.P$2
N$19
  Top 0.254: R11.P$1 28.45,7.75 28.45,3.43 29.97,1.91 IND2.A
N$20
  Top 0.254: R10.P$1 28.45,10.41 29.46,10.41 37.97,1.91 IND1.A
N$24
  Top 0.254: IC1.3 22.73,35.18 22.73,29.84 21.72,28.83 21.72,19.68 25.15,16.26 25.15,4.7 BAT1.PWR@1
N$25
  Top 0.254: IC1.1 27.8,35.3 Y1.X2
N$26
  Top 0.254: IC1.2 25.27,35.31 25.27,38.86 Y1.X1
OE
  Top 0.254: CPU2.15 67.18,21.08 71.63,25.53 72.39,25.53 73.28,26.42 73.28,33.15 DISPLAY.15
R1
  Bottom 0.254: CPU2.4 40.13,13.21 42.8,10.54 58.55,10.54 60.2,8.89 65.02,8.89 71.5,15.37 73.28,15.37 DISPLAY.1
R2
  Top 0.254: CPU2.11 58.29,13.46 64.14,19.3 67.94,19.3 71.37,22.73 72.9,22.73 74.04,21.59 DISPLAY.5
RAW_PWR
  Top 0.508: 5.21,47.62 PWR1.1
  Top 1.016: JP4.PWR 10.61,21.4 12.19,19.81 12.19,16.94 C7.PLUS
  Top 2.032: 5.08,47.75 5.21,47.62 9.14,43.69 9.14,41.66 12.7,38.1 14.99,38.1 15.24,37.85
  Bottom 2.032: RUEF250.P1 12.76,38.04 9.14,41.66 9.14,43.71 PWR1.1
  Bottom 3.81: JP4.PWR 10.61,25.59 16,30.99 16,37.14 RUEF250.P1
RST1
  Top 0.254: R12.P$1 68.33,10.29 65.79,7.75 65.79,7.37 C4.1 65.66,7.24 64.14,7.24 57.4,0.51 43.31,0.51 39.5,4.32 39.5,6.1 36.45,9.14 35.43,9.14 32.51,12.06 CPU2.1 32,13.46 27.56,17.91 RST2.2
  Bottom 0.254: RST2.1 21.08,18.03 27.43,18.03 RST2.2
RST2
  Top 0.254: CPU1.1 31.5,43.69 R22.P$1 | RST1.1 9.4,60.83 15.75,60.83 RST1.2
  Bottom 0.254: CPU1.1 22.86,46.48 21.34,48.01 C8.1 19.18,49.15 19.18,55.37 15.88,58.67 15.88,60.71 RST1.2
RX-I1
  Top 0.254: CPU2.2 35.43,13.46 37.72,15.75 44.58,15.75 49.15,20.32 49.15,24 50.42,25.27 50.42,25.78 51.18,26.54 62.99,26.54 64.39,25.15 64.39,20.32 59.31,15.24 57.53,15.24 56.77,14.48 56.77,12.45 57.53,11.68 68.96,11.68 69.72,10.92 69.72,9.78 68.33,8.38 67.82,8.38 67.18,7.75 67.18,6.86 71.12,2.92 PROGRAM2.3
RX-I2
  Top 0.254: CPU1.2 34.04,49.28 32.89,50.42 32.89,60.07 33.53,60.71 PROGRAM1.3
SCL
  Top 0.254: CPU1.28 31.5,48.64 32.89,47.24 32.89,44.2 34.67,42.42 34.67,40.01 35.69,38.99 36.83,38.99 37.72,38.1 37.72,36.32 36.58,35.18 R2.P$1
  Bottom 0.254: I2C5V.3 41.15,40.51 36.58,35.94 36.58,35.18 R2.P$1 36.45,35.05 34.42,33.02 28.45,33.02 23.11,27.69 22.86,27.69 IC1.6
SCL3V3
  Bottom 0.254: I2C3V3.3 41.78,25.91 43.18,24.51 46.35,24.51 49.15,27.3 53.85,27.3 56.9,30.35 63.75,30.35 67.44,34.04 67.44,60.45 JHTU21D.4
SDA
  Top 0.254: R1.P$1 42.16,37.59 I2C5V.2 35.43,44.32 35.43,47.24 34.54,48.13 34.54,49.53 34.04,50.04 CPU1.27
  Bottom 0.254: I2C5V.2 37.21,39.75 36.58,39.75 34.92,38.1 34.92,37.08 31.37,33.53 26.42,33.53 20.57,27.69 20.32,27.69 IC1.5
SDA3V3
  Bottom 0.254: I2C3V3.2 39.24,25.91 44.2,30.86 63.5,30.86 66.17,33.53 66.17,59.31 65.02,60.45 JHTU21D.3
TX-O1  (via drill 0.38)
  Top 0.254: v39.37,16.51 42.8,16.51 46.61,20.32 46.61,24.51 49.4,27.3 v63.25,27.3
  Bottom 0.254: CPU2.3 37.59,14.73 v39.37,16.51 | v63.25,27.3 71.37,35.43 74.93,35.43 77.09,33.27 77.09,4.95 PROGRAM2.2
TX-O2
  Bottom 0.254: CPU1.3 36.58,49.4 33.66,52.32 31.11,52.32 30.1,53.34 30.1,59.82 30.99,60.71 PROGRAM1.2
VLIGHT
  Top 0.254: LIGHT.1 20.07,43.69 28.07,51.69 28.07,52.45 R13.P$1
  Bottom 0.254: CPU1.23 44.2,53.72 37.72,47.24 37.72,45.47 36.96,44.7 36.2,44.7 35.18,45.72 35.18,47.5 31.37,51.31 29.34,51.31 28.19,52.45 R13.P$1

### Text on the board
tPlace: DTR | GND | + | 5V | - | + | GND | OE | LAT | - | GND | C | B | A | 3V3 | GND | B2 | G2 | R2 | GND | B1 | G1 | R1 | GND | DTR
bPlace: + | - | + | - | + | - | -